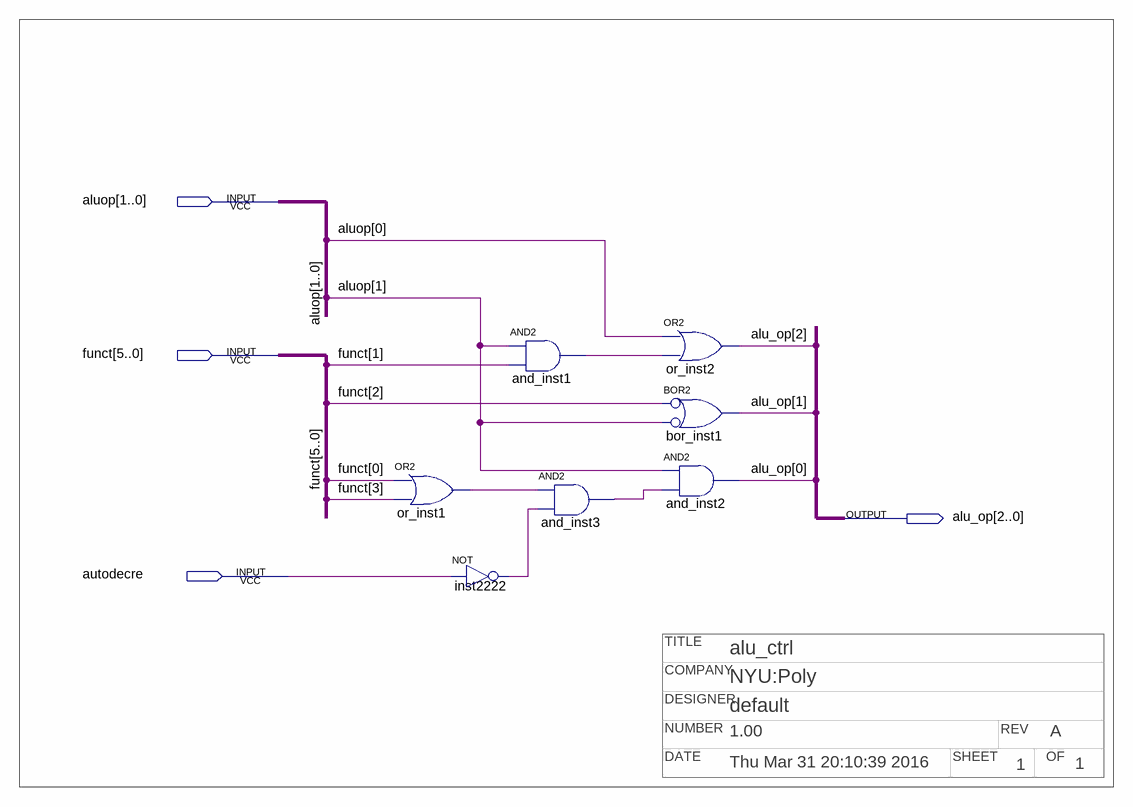
[diagram p0: schematic sheet]
// Quartus schematic alu_ctrl.bdf as structural Verilog: 7 symbols, 4 pins
// Title block: COMPANY: NYU:Poly; DATE: Thu Mar 31 20:10:39 2016; DESIGNER: default; NUMBER: 1.00; OF: 1; REV: A; SHEET: 1; TITLE: alu_ctrl
module alu_ctrl (
  input  [1:0] aluop,
  input  [5:0] funct,
  input  autodecre,
  output [2:0] alu_op
);

  wire and_inst1_out, and_inst3_out, inst2222_out, or_inst1_out;

  or or_inst1 (or_inst1_out, funct[0], funct[3]);
  and and_inst1 (and_inst1_out, aluop[1], funct[1]);
  not inst2222 (inst2222_out, autodecre);
  and and_inst3 (and_inst3_out, or_inst1_out, inst2222_out);
  or or_inst2 (alu_op[2], aluop[0], and_inst1_out);
  or bor_inst1 (alu_op[1], ~funct[2], ~aluop[1]);  // BOR2
  and and_inst2 (alu_op[0], aluop[1], and_inst3_out);
endmodule
